# EAGLE design uio_u (EAGLE 6.4)
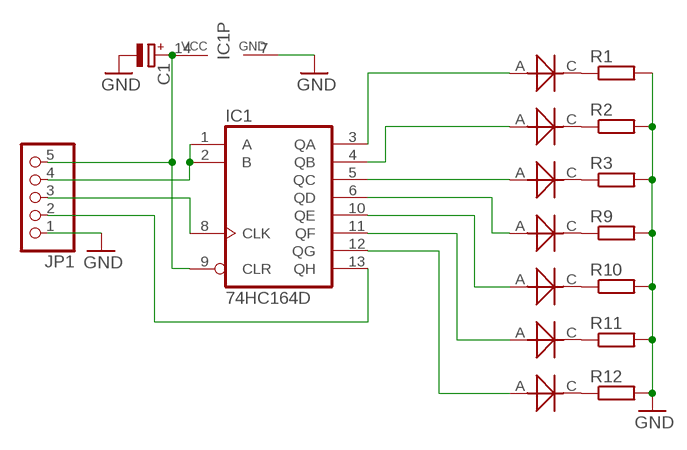
[diagram p0: schematic, sheet 1]

## Parts
C1  CPOL-EUSMCA  [SMC_A]
IC1  74HC164D  [SO14]
JP1  PINHD-1X05_2.54-S  [1X05-S]
R1  R_0805  [R0805]
R2  R_0805  [R0805]
R3  R_0805  [R0805]
R9  R_0805  [R0805]
R10  R_0805  [R0805]
R11  R_0805  [R0805]
R12  R_0805  [R0805]
U$1  LED5X2  [LED_5X2]
U$2  LED5X2  [LED_5X2]
U$3  LED5X2  [LED_5X2]
U$4  LED5X2  [LED_5X2]
U$11  LED5X2  [LED_5X2]
U$12  LED5X2  [LED_5X2]
U$13  LED5X2  [LED_5X2]

## Nets
GND: C1.- IC1.7(GND) JP1.1 R1.2 R2.2 R3.2 R9.2 R10.2 R11.2 R12.2
LED1: IC1.3(QA) U$4.A
LED2: IC1.4(QB) U$2.A
LED3: IC1.5(QC) U$3.A
LED5: IC1.6(QD) U$13.A
LED6: IC1.10(QE) U$1.A
LED7: IC1.11(QF) U$11.A
LED8: IC1.12(QG) U$12.A
N$1: R1.1 U$4.C
N$2: R2.1 U$2.C
N$3: R3.1 U$3.C
N$7: IC1.13(QH) JP1.2
N$8: IC1.8(CLK) JP1.3
N$9: IC1.1(A) IC1.2(B) JP1.4
N$13: C1.+ IC1.9(CLR) IC1.14(VCC) JP1.5
N$17: R9.1 U$13.C
N$18: R10.1 U$1.C
N$19: R11.1 U$11.C
N$20: R12.1 U$12.C

## Library data of the parts
C1 = _rcl:CPOL-EU: POLARIZED CAPACITOR, European symbol
IC1 = 74xx-eu:74*164: 8-bit parallel out SHIFT REGISTER
JP1 = pinhead-2:PINHD-1X05: PIN HEADER
R1-R3 R9-R12 = _moja:R
U$1-U$4 U$11-U$13 = _moja:LED

## Board
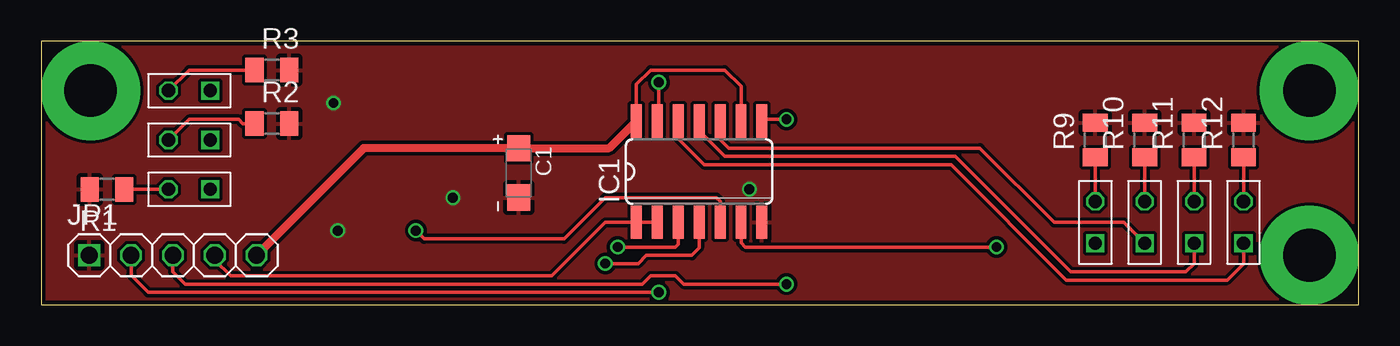
[diagram p1: board, top side]
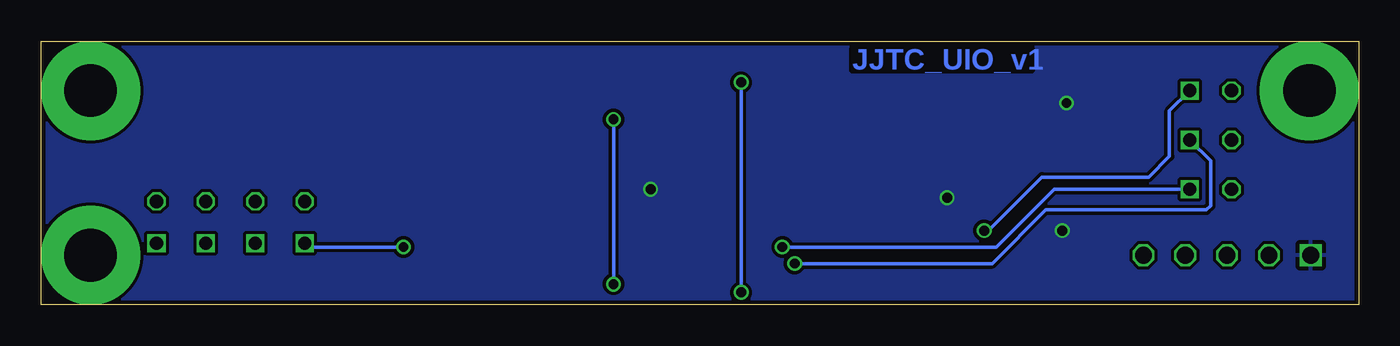
[diagram p2: board, bottom side, seen from below]

Size 80 x 16 mm. Coordinates in mm from the lower left corner, seen from the top.
Outline: 0,0 80,0 80,16 0,16 0,0
Copper layers (1*16): Top 0.035mm / dielectric 1.5mm / Bottom 0.035mm
Design rules "ch_6": minimum track width 0.15mm, minimum drill 0.4mm, track to track 0.2mm, track to pad 0.2mm, pad to pad 0.2mm, via to via 0.2mm, smd to smd 0.2mm, copper to edge 10mil, drill to drill 8mil, minimum pad ring 0.15mm, minimum via ring 0.15mm, stop-mask expansion 4mil, vias tented up to drill 0mil, thermal gap 10mil

### Footprints (pad centres in the part's own frame; a part is rotated, then mirrored left to right if it is on the bottom)
SMC_A = smd 1.6 x 1.4: + -1.5,0; - 1.5,0
SO14 = smd 0.66 x 2.032: 1 -3.81,-3.073; 2 -2.54,-3.073; 3 -1.27,-3.073; 4 0,-3.073; 5 1.27,-3.073; 6 2.54,-3.073; 7 3.81,-3.073; 8 3.81,3.073; 9 2.54,3.073; 10 1.27,3.073; 11 0,3.073; 12 -1.27,3.073; 13 -2.54,3.073; 14 -3.81,3.073
1X05-S = drill 1.016 square: 1 -5.08,0 | drill 1.016 octagon: 2 -2.54,0; 3 0,0; 4 2.54,0; 5 5.08,0
R0805 = smd 1.1 x 1.5: 1 -1.05,0; 2 1.05,0
LED_5X2 = drill 0.8 square: A -1.27,0 | drill 0.8 octagon: C 1.27,0

### Placement (x,y rotation side)
C1  29,8 270 top
IC1  39.95,8.08 0 top
JP1  8,3 0 top
R1  4,7 180 top
R2  14,11 0 top
R3  14,14.25 0 top
R9  64,10 90 top
R10  67,10 90 top
R11  70,10 90 top
R12  73,10 90 top
U$1  67,5 90 top
U$2  9,10 180 top
U$3  9,13 180 top
U$4  9,7 180 top
U$11  70,5 90 top
U$12  73,5 90 top
U$13  64,5 90 top

### Tracks (layer width: path | path; a pad name or v marks a point on that pad's centre or on a via)
GND  (via drill 0.6)
  other vias: 18,4.5 25,6.5 17.75,12.25 43,7
  pour Bottom: 0,0 80,0 80,16 0,16
  pour Top: 0,0 80,0 80,16 0,16
LED1  (via drill 0.6)
  Top 0.2: IC1.3 38.68,3.68 38.5,3.5 v35,3.5
  Bottom 0.2: v35,3.5 22,3.5 18.5,7 U$4.A
LED2  (via drill 0.6)
  Top 0.2: IC1.4 39.95,3.45 39.5,3 36.75,3 36.25,2.5 v34.25,2.5
  Bottom 0.2: v34.25,2.5 22.25,2.5 19,5.75 9.25,5.75 9,6 9,8.73 U$2.A
LED3  (via drill 0.6)
  Top 0.2: IC1.5 41.22,6.28 41,6.5 34.25,6.5 31.75,4 23.25,4 v22.75,4.5
  Bottom 0.2: v22.75,4.5 22.5,4.5 19.25,7.75 12.75,7.75 11.5,9 11.5,11.77 U$3.A
LED5  (via drill 0.6)
  Top 0.2: IC1.6 42.49,3.76 42.75,3.5 v58,3.5
  Bottom 0.2: v58,3.5 63.77,3.5 U$13.A
LED6
  Top 0.2: IC1.10 41.22,10.03 41.75,9.5 57,9.5 61.5,5 65.73,5 U$1.A
LED7
  Top 0.2: IC1.11 39.95,10.55 41.5,9 55.5,9 62.5,2 69.5,2 70,2.5 U$11.A
LED8
  Top 0.2: IC1.12 38.68,10.07 40.25,8.5 55.25,8.5 62.25,1.5 72,1.5 73,2.5 U$12.A
N$1
  Top 0.2: R1.1 U$4.C
N$2
  Top 0.2: R2.1 12.25,11 12,11.25 8.98,11.25 U$2.C
N$3
  Top 0.2: R3.1 8.98,14.25 U$3.C
N$4  (via drill 3.2 pad 6)
  other vias: 77,3
N$5  (via drill 3.2 pad 6)
  other vias: 77,13
N$6  (via drill 3.2 pad 6)
  other vias: 3,13
N$7  (via drill 0.6)
  Top 0.2: JP1.2 5.46,1.79 6.5,0.75 v37.5,0.75 | v37.5,13.5 37.5,11.24 IC1.13
  Bottom 0.2: v37.5,0.75 v37.5,13.5
N$8  (via drill 0.6)
  Top 0.2: JP1.3 8,2 8.75,1.25 36.5,1.25 37,1.75 38.5,1.75 39,1.25 v45.25,1.25 | v45.25,11.25 43.86,11.25 IC1.8
  Bottom 0.2: v45.25,1.25 v45.25,11.25
N$9
  Top 0.2: JP1.4 10.54,2.71 11.5,1.75 31,1.75 34.25,5 IC1.1 IC1.2
N$13
  Top 0.2: IC1.14 36.14,13.39 37,14.25 41.5,14.25 42.5,13.25 42.5,11.16 IC1.9
  Top 0.5: IC1.14 34.49,9.5 C1.+ 19.58,9.5 JP1.5
N$17
  Top 0.2: U$13.C R9.1
N$18
  Top 0.2: R10.1 U$1.C
N$19
  Top 0.2: R11.1 U$11.C
N$20
  Top 0.2: R12.1 U$12.C

### Text on the board
Bottom: JJTC_UIO_v1